# EAGLE design 555-Synth (EAGLE 7.2.0)
Switchable Capacitor Oscillator using 555 Timer
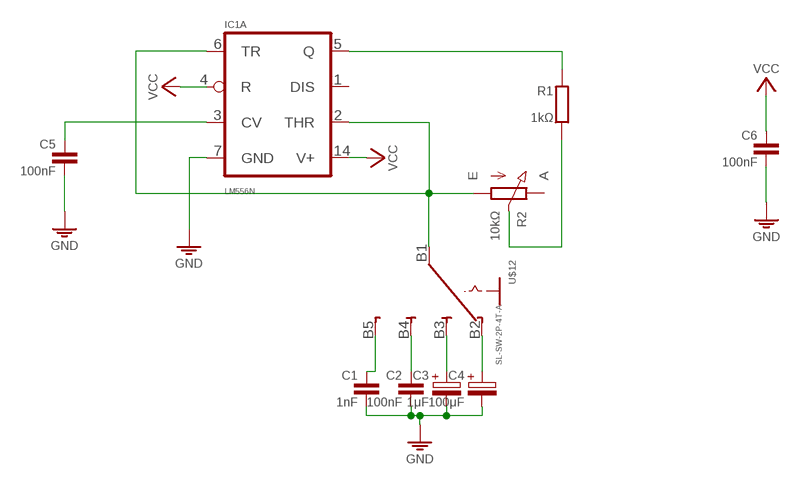
[diagram p0: schematic, sheet 1]

## Parts
C1  1nF  C050-020X044/V  [C050-020X044/V]
C2  100nF  C050-020X044/V  [C050-020X044/V]
C3  1μF  CPOLE2,5-5/V  [E2,5-5/V]
C4  100μF  CPOLE2,5-5/V  [E2,5-5/V]
C5  100nF  C050-020X044/V  [C050-020X044/V]
C6  100nF  C050-020X044/V  [C050-020X044/V]
IC1  LM556N  [DIL14]
J1  VCC_GNDL  [SPAD-+]
R1  1kΩ  R0204/10-V  [0204/10-V]
R2  10kΩ  POT-3P  [CONN-3P]
U$1  SL-SW-2P-4T-A  [SLSW-2P4T-2-H]

## Nets
GND: C1.2 C2.2 C3.- C4.- C5.2 C6.2 IC1.7(A:GND) J1.1
N$1: IC1.2(A:THR) IC1.6(A:TR) R2.1(A) U$1.B1(2:P)
N$2: R1.2 R2.2(S)
N$3: IC1.5(A:Q) R1.1
N$4: C1.1 U$1.B5(2:D)
N$5: C2.1 U$1.B4(2:C)
N$6: C3.+ U$1.B3(2:B)
N$7: C4.+ U$1.B2(2:A)
N$10: C5.1 IC1.3(A:CV)
VCC: C6.1 IC1.4(A:R) IC1.14(A:V+) J1.2
Unconnected: IC1.1(A:DIS) IC1.8(B:TR) IC1.9(B:Q) IC1.10(B:R) IC1.11(B:CV) IC1.12(B:THR) IC1.13(B:DIS) R2.3(E) U$1.A1(1:P) U$1.A2(1:A) U$1.A3(1:B) U$1.A4(1:C) U$1.A5(1:D)

## Library data of the parts
C1 C2 C5 C6 = c:C: CAPACITOR, European symbol
C3 C4 = c:CPOL: POLARIZED CAPACITOR, European symbol
IC1 = ic:*556: Dual Timer http://www.ti.com/lit/ds/symlink/lm556.pdf
J1 = pad:VCC_GND
R1 = r:R: RESISTOR, European symbol
R2 = r:POT
U$1 = sw:SL-SW-2P-4T

## Net classes
0 default: width 0.61 mm

## Board
Switchable Capacitor Oscillator using 555 Timer
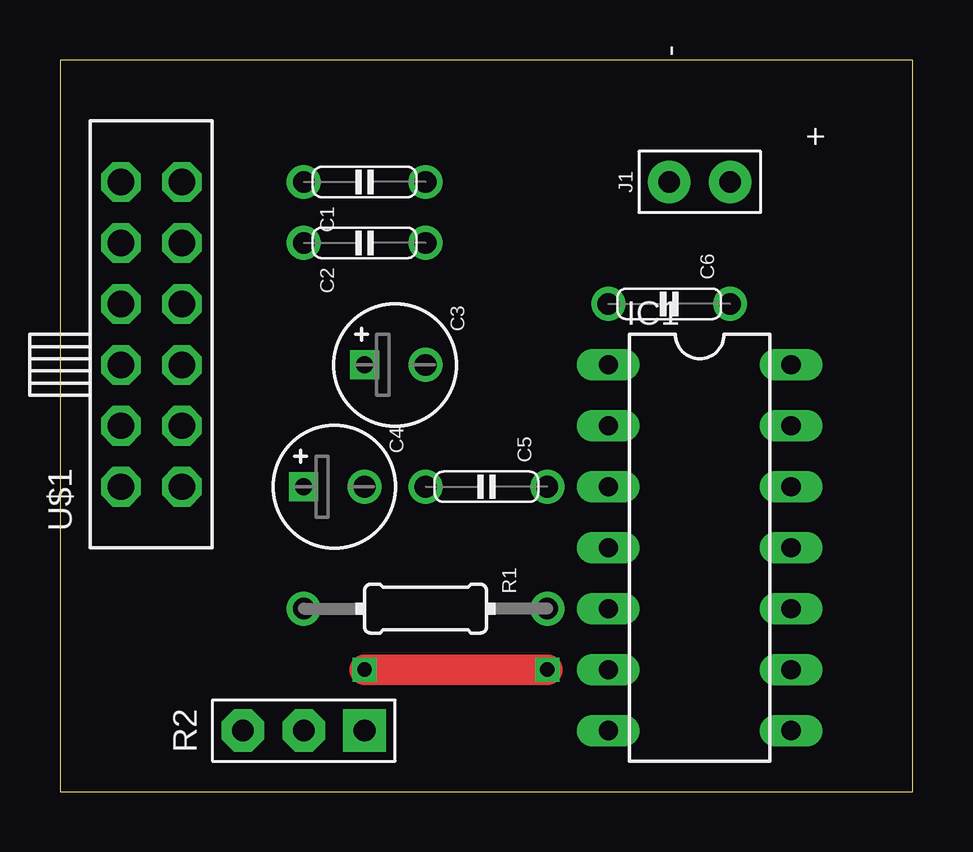
[diagram p1: board, top side]
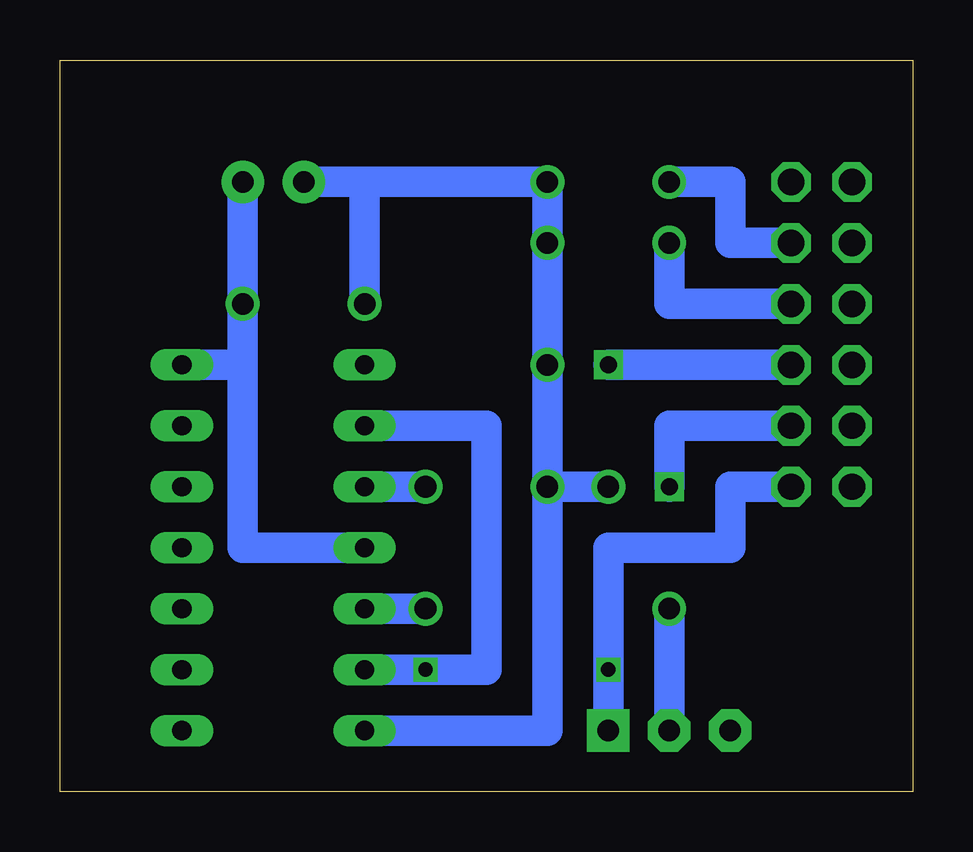
[diagram p2: board, bottom side, seen from below]

Size 35.56 x 30.48 mm. Coordinates in mm from the lower left corner, seen from the top.
Outline: 0,0 35.56,0 35.56,30.48 0,30.48 0,0
Copper layers (1*16): Top 0.035mm / dielectric 1.5mm / Bottom 0.035mm
Design rules "default": minimum track width 10mil, minimum drill 24mil, track to track 8mil, track to pad 8mil, pad to pad 8mil, via to via 8mil, smd to smd 8mil, copper to edge 40mil, drill to drill 8mil, minimum pad ring 10mil, minimum via ring 8mil, stop-mask expansion 4mil, vias tented up to drill 0mil, thermal gap 10mil

### Footprints (pad centres in the part's own frame; a part is rotated, then mirrored left to right if it is on the bottom)
C050-020X044/V = drill 0.9: 1 0,2.54; 2 0,-2.54
E2,5-5/V = drill 0.7 square: + 0,-1.27 | drill 0.9: - 0,1.27
DIL14 = drill 0.8 long: 1 -3.81,7.62; 2 -3.81,5.08; 3 -3.81,2.54; 4 -3.81,0; 5 -3.81,-2.54; 6 -3.81,-5.08; 7 -3.81,-7.62; 8 3.81,-7.62; 9 3.81,-5.08; 10 3.81,-2.54; 11 3.81,0; 12 3.81,2.54; 13 3.81,5.08; 14 3.81,7.62
SPAD-+ = drill 0.9 pad 1.778: 1 0,-1.27; 2 0,1.27
0204/10-V = drill 0.9: 1 0,5.08; 2 0,-5.08
CONN-3P = drill 0.9 pad 1.778 square: 1 0,-2.54 | drill 0.9 pad 1.778 octagon: 2 0,0; 3 0,2.54
SLSW-2P4T-2-H = drill 1.1 pad 1.524 octagon: A1 -6.35,1.27; A2 -3.81,1.27; A3 -1.27,1.27; A4 1.27,1.27; A5 3.81,1.27; A6 6.35,1.27; B1 -6.35,-1.27; B2 -3.81,-1.27; B3 -1.27,-1.27; B4 1.27,-1.27; B5 3.81,-1.27; B6 6.35,-1.27

### Placement (x,y rotation side)
C1  12.7,25.4 90 top
C2  12.7,22.86 90 top
C3  13.97,17.78 270 top
C4  11.43,12.7 270 top
C5  17.78,12.7 270 top
C6  25.4,20.32 270 top
IC1  26.67,10.16 0 top
J1  26.67,25.4 270 top
R1  15.24,7.62 270 top
R2  10.16,2.54 90 top
U$1  3.81,19.05 90 top

### Tracks (layer width: path | path; a pad name or v marks a point on that pad's centre or on a via)
GND
  Bottom 1.27: C5.2 15.24,2.54 IC1.7 | C5.2 C4.- | C5.2 C3.- C2.2 C1.2 22.86,25.4 | C6.2 22.86,25.4 | J1.1 22.86,25.4
N$1  (via drill 0.6)
  Top 1.27: v20.32,5.08 v12.7,5.08
  Bottom 1.27: IC1.2 17.78,15.24 17.78,5.08 v20.32,5.08 IC1.6 | U$1.B1 7.62,12.7 7.62,10.16 12.7,10.16 v12.7,5.08 R2.1
N$2
  Bottom 1.27: R2.2 R1.2
N$3
  Bottom 1.27: IC1.5 R1.1
N$4
  Bottom 1.27: U$1.B5 7.62,22.86 7.62,25.4 C1.1
N$5
  Bottom 1.27: U$1.B4 10.16,20.32 C2.1
N$6
  Bottom 1.27: U$1.B3 C3.+
N$7
  Bottom 1.27: C4.+ 10.16,15.24 U$1.B2
N$10
  Bottom 1.27: IC1.3 C5.1
VCC
  Bottom 1.27: IC1.4 27.94,10.16 27.94,17.78 | J1.2 C6.1 27.94,17.78 | IC1.14 27.94,17.78